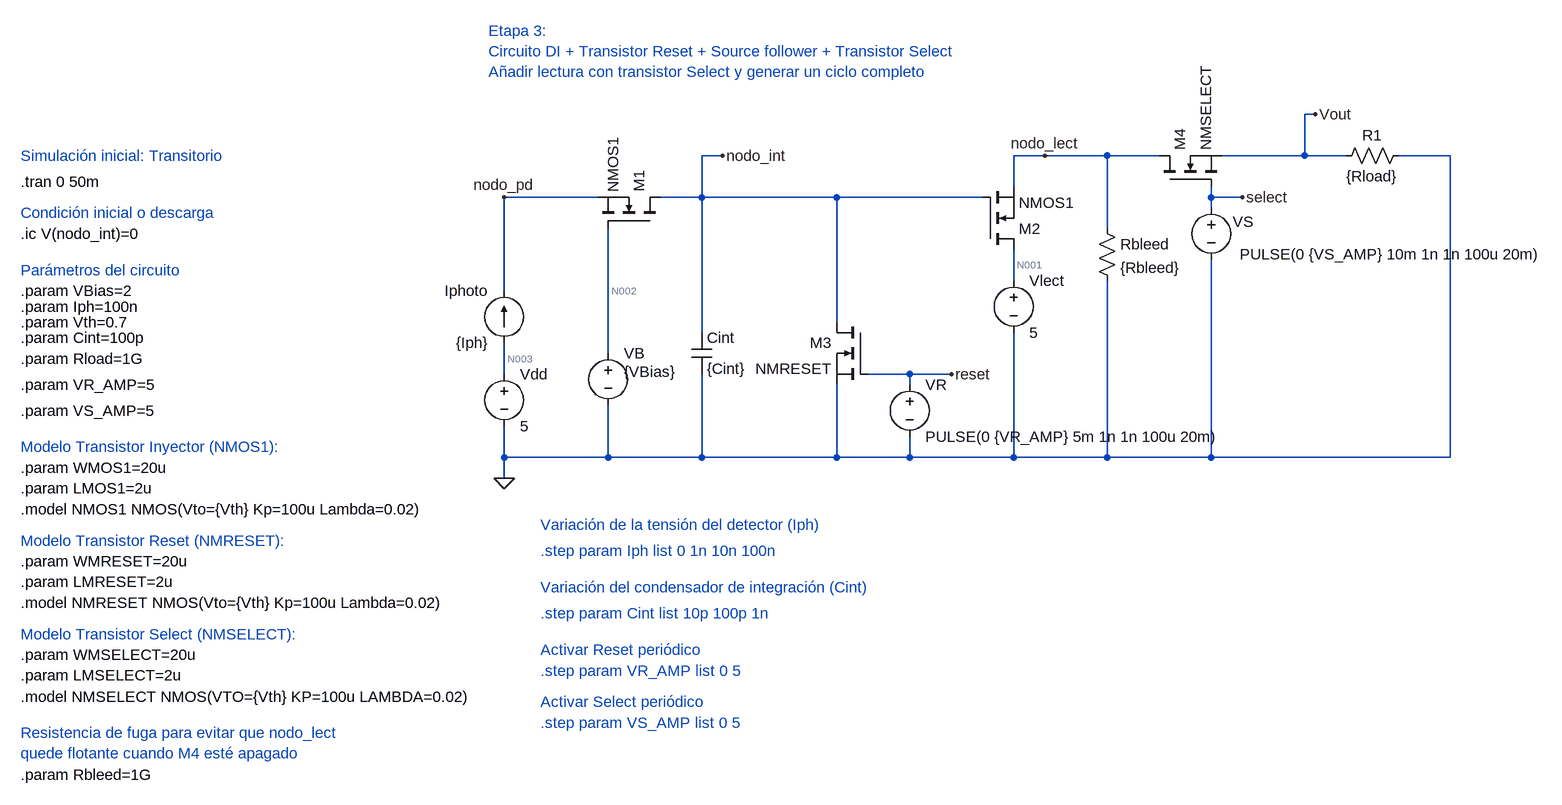
[diagram p0: schematic ID_Definitivo.asc]
ID_Definitivo.asc, the LTspice schematic file:
Version 4.1
SHEET 1 1592 1016
WIRE 816 -64 800 -64
WIRE -96 0 -128 0
WIRE 400 0 352 0
WIRE 496 0 400 0
WIRE 576 0 496 0
WIRE 800 0 800 -64
WIRE 800 0 672 0
WIRE 864 0 800 0
WIRE 1024 0 944 0
WIRE 352 48 352 0
WIRE -288 64 -432 64
WIRE -128 64 -128 0
WIRE -128 64 -192 64
WIRE 80 64 -128 64
WIRE 304 64 80 64
WIRE 656 64 656 48
WIRE 704 64 656 64
WIRE 656 80 656 64
WIRE 496 112 496 0
WIRE 352 192 352 144
WIRE -432 208 -432 64
WIRE 80 256 80 64
WIRE -128 272 -128 64
WIRE -272 304 -272 112
WIRE -432 336 -432 288
WIRE 192 336 128 336
WIRE 256 336 192 336
WIRE 192 352 192 336
WIRE -432 464 -432 416
WIRE -272 464 -272 384
WIRE -272 464 -432 464
WIRE -128 464 -128 336
WIRE -128 464 -272 464
WIRE 80 464 80 352
WIRE 80 464 -128 464
WIRE 192 464 192 432
WIRE 192 464 80 464
WIRE 352 464 352 272
WIRE 352 464 192 464
WIRE 496 464 496 192
WIRE 496 464 352 464
WIRE 656 464 656 160
WIRE 656 464 496 464
WIRE 1024 464 1024 0
WIRE 1024 464 656 464
WIRE -432 496 -432 464
FLAG -96 0 nodo_int
FLAG -432 496 0
FLAG 256 336 reset
FLAG 816 -64 Vout
FLAG 704 64 select
FLAG 400 0 nodo_lect
FLAG -432 64 nodo_pd
SYMBOL current -432 288 R180
WINDOW 0 24 80 Left 2
WINDOW 3 24 0 Left 2
SYMATTR InstName Iphoto
SYMATTR Value {Iph}
SYMBOL nmos -192 112 M270
SYMATTR InstName M1
SYMATTR Value NMOS1
SYMATTR SpiceLine W={WMOS1} L={LMOS1}
SYMBOL cap -144 272 R0
SYMATTR InstName Cint
SYMATTR Value {Cint}
SYMBOL voltage -272 288 R0
WINDOW 3 24 44 Left 2
SYMATTR Value {VBias}
SYMATTR InstName VB
SYMBOL voltage -432 320 R0
WINDOW 123 0 0 Left 0
WINDOW 39 0 0 Left 0
SYMATTR InstName Vdd
SYMATTR Value 5
SYMBOL voltage 192 336 R0
WINDOW 123 0 0 Left 0
WINDOW 39 0 0 Left 0
SYMATTR InstName VR
SYMATTR Value PULSE(0 {VR_AMP} 5m 1n 1n 100u 20m)
SYMBOL nmos 128 256 M0
SYMATTR InstName M3
SYMATTR Value NMRESET
SYMATTR SpiceLine W={WMRESET} L={LMRESET}
SYMBOL nmos 576 48 R270
SYMATTR InstName M4
SYMATTR Value NMSELECT
SYMATTR SpiceLine W={WMSELECT} L={LMSELECT}
SYMBOL voltage 656 64 R0
WINDOW 0 49 22 Top 2
WINDOW 3 276 103 Bottom 2
WINDOW 123 0 0 Left 0
WINDOW 39 0 0 Left 0
SYMATTR InstName VS
SYMATTR Value PULSE(0 {VS_AMP} 10m 1n 1n 100u 20m)
SYMBOL res 848 16 R270
WINDOW 0 32 56 VTop 2
WINDOW 3 0 56 VBottom 2
SYMATTR InstName R1
SYMATTR Value {Rload}
SYMBOL nmos 304 144 M180
SYMATTR InstName M2
SYMATTR Value NMOS1
SYMBOL voltage 352 176 R0
SYMATTR InstName Vlect
SYMATTR Value 5
SYMBOL res 480 96 R0
SYMATTR InstName Rbleed
SYMATTR Value {Rbleed}
TEXT -456 -192 Left 2 ;Etapa 3: \nCircuito DI + Transistor Reset + Source follower + Transistor Select\nAñadir lectura con transistor Select y generar un ciclo completo
TEXT -1176 544 Left 2 !.model NMOS1 NMOS(Vto={Vth} Kp=100u Lambda=0.02)
TEXT -1176 480 Left 2 !.param WMOS1=20u\n.param LMOS1=2u
TEXT -1176 448 Left 2 ;Modelo Transistor Inyector (NMOS1):
TEXT -1176 0 Left 2 ;Simulación inicial: Transitorio
TEXT -1176 120 Left 2 !.ic V(nodo_int)=0
TEXT -1176 88 Left 2 ;Condición inicial o descarga
TEXT -1176 208 Left 2 !.param VBias=2
TEXT -1176 232 Left 2 !.param Iph=100n
TEXT -1176 256 Left 2 !.param Vth=0.7
TEXT -1176 176 Left 2 ;Parámetros del circuito
TEXT -376 568 Left 2 ;Variación de la tensión del detector (Iph)
TEXT -376 608 Left 2 ;.step param Iph list 0 1n 10n 100n
TEXT -1176 280 Left 2 !.param Cint=100p
TEXT -1176 40 Left 2 !.tran 0 50m
TEXT -1176 592 Left 2 ;Modelo Transistor Reset (NMRESET):
TEXT -1176 624 Left 2 !.param WMRESET=20u\n.param LMRESET=2u
TEXT -1176 688 Left 2 !.model NMRESET NMOS(Vto={Vth} Kp=100u Lambda=0.02)
TEXT -376 664 Left 2 ;Variación del condensador de integración (Cint)
TEXT -376 704 Left 2 ;.step param Cint list 10p 100p 1n
TEXT -1176 352 Left 2 !.param VR_AMP=5
TEXT -376 792 Left 2 ;.step param VR_AMP list 0 5
TEXT -376 760 Left 2 ;Activar Reset periódico
TEXT -1176 832 Left 2 !.model NMSELECT NMOS(VTO={Vth} KP=100u LAMBDA=0.02)
TEXT -1176 736 Left 2 ;Modelo Transistor Select (NMSELECT):
TEXT -1176 768 Left 2 !.param WMSELECT=20u\n.param LMSELECT=2u
TEXT -1176 312 Left 2 !.param Rload=1G
TEXT -1176 392 Left 2 !.param VS_AMP=5
TEXT -376 840 Left 2 ;Activar Select periódico
TEXT -376 872 Left 2 ;.step param VS_AMP list 0 5
TEXT -1176 888 Left 2 ;Resistencia de fuga para evitar que nodo_lect \nquede flotante cuando M4 esté apagado
TEXT -1176 952 Left 2 !.param Rbleed=1G

The netlist it stands for:
* ID_Definitivo.asc
Iphoto N003 nodo_pd {Iph}
M1 nodo_int N002 nodo_pd nodo_pd NMOS1 W={WMOS1} L={LMOS1}
Cint nodo_int 0 {Cint}
VB N002 0 {VBias}
Vdd N003 0 5
VR reset 0 PULSE(0 {VR_AMP} 5m 1n 1n 100u 20m)
M3 nodo_int reset 0 0 NMRESET W={WMRESET} L={LMRESET}
M4 nodo_lect select Vout Vout NMSELECT W={WMSELECT} L={LMSELECT}
VS select 0 PULSE(0 {VS_AMP} 10m 1n 1n 100u 20m)
R1 Vout 0 {Rload}
M2 N001 nodo_int nodo_lect nodo_lect NMOS1
Vlect N001 0 5
Rbleed nodo_lect 0 {Rbleed}
.model NMOS NMOS
.model PMOS PMOS
.lib standard.mos
* Etapa 3:
* Circuito DI + Transistor Reset + Source follower + Transistor Select
* Añadir lectura con transistor Select y generar un ciclo completo
.model NMOS1 NMOS(Vto={Vth} Kp=100u Lambda=0.02)
.param WMOS1=20u
.param LMOS1=2u
* Modelo Transistor Inyector (NMOS1):
* Simulación inicial: Transitorio
.ic V(nodo_int)=0
* Condición inicial o descarga
.param VBias=2
.param Iph=100n
.param Vth=0.7
* Parámetros del circuito
* Variación de la tensión del detector (Iph)
* .step param Iph list 0 1n 10n 100n
.param Cint=100p
.tran 0 50m
* Modelo Transistor Reset (NMRESET):
.param WMRESET=20u
.param LMRESET=2u
.model NMRESET NMOS(Vto={Vth} Kp=100u Lambda=0.02)
* Variación del condensador de integración (Cint)
* .step param Cint list 10p 100p 1n
.param VR_AMP=5
* .step param VR_AMP list 0 5
* Activar Reset periódico
.model NMSELECT NMOS(VTO={Vth} KP=100u LAMBDA=0.02)
* Modelo Transistor Select (NMSELECT):
.param WMSELECT=20u
.param LMSELECT=2u
.param Rload=1G
.param VS_AMP=5
* Activar Select periódico
* .step param VS_AMP list 0 5
* Resistencia de fuga para evitar que nodo_lect
* quede flotante cuando M4 esté apagado
.param Rbleed=1G
.backanno
.end

* Results of the author's LTspice run, read from the files saved beside the schematic
* Operating Point, zero values left out:
*   V(n001) = 5 V
*   V(n002) = 2 V
*   V(n003) = 5 V
*   V(nodo_lect) = 9.967 mV
*   V(nodo_pd) = 76.93 µV
*   V(vout) = 23.08 µV
*   I(Iphoto) = 100 nA
*   I(Rbleed) = 9.967 pA
*   I(Vdd) = -100 nA
*   I(Vlect) = -9.99 pA
*   Ib(M2) = -5 pA
*   Id(M1) = -100 nA
*   Id(M2) = 9.99 pA
*   Is(M1) = 100 nA
*   Is(M2) = -4.99 pA
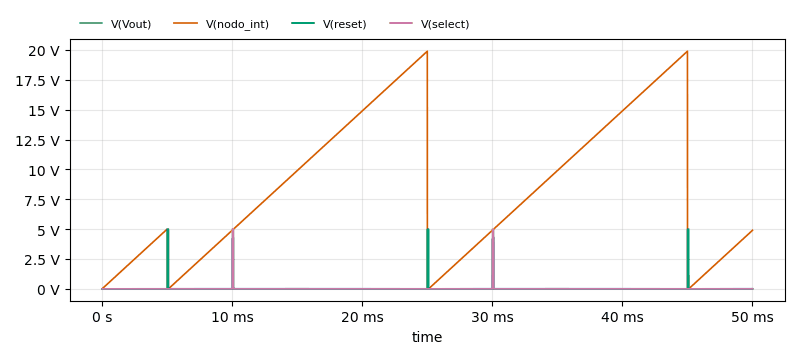
[diagram p1: Transient Analysis of ID_Definitivo.asc, plotted from the saved traces]
* Transient Analysis, 1 run:
*   V(Vout): min 23.08 µV, max 4.286 V, average 24.31 mV, rms 268.1 mV, last 8.375 mV
*   V(nodo_int): min 0 V, max 19.9 V, average 8.409 V, rms 10.33 V, last 4.9 V
*   V(reset): min 0 V, max 5 V, average 30 mV, rms 387.3 mV, last 0 V
*   V(select): min 0 V, max 5 V, average 20 mV, rms 316.2 mV, last 0 V